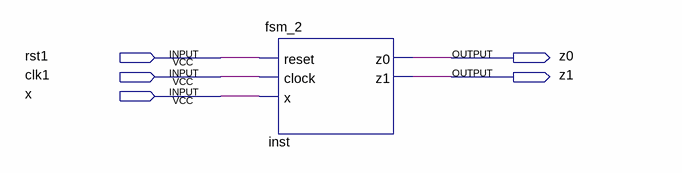
[diagram p0: schematic sheet]
// Quartus schematic bloque_fsm_2.bdf as structural Verilog: 1 symbols, 5 pins
module bloque_fsm_2 (
  input  rst1,
  input  clk1,
  input  x,
  output z0,
  output z1
);

  fsm_2 inst (.reset(rst1), .clock(clk1), .x(x), .z0(z0), .z1(z1));
endmodule
